# Altium schematic sheet [0] Top.SchDoc
size A4
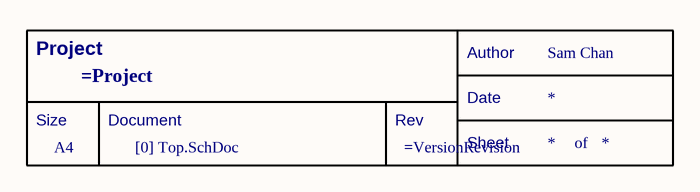
[diagram p0: [0] Top.SchDoc]

## Parts
*  Title Block  (value not drawn)  (graphical)

## Notes on the sheet
- (in symbol Title Block) Project; Author; Sam Chan; Date; Size; Document; Rev; A4; Sheet; of

## Library data of the parts
* = Title Block: Standard Title Block